# Altium schematic sheet Engine.SchDoc: ENGINE MANAGEMENT BOARD
size Letter; DrawnBy: Prithvi Shankara; DocumentNumber: 1; Revision: A; SheetNumber: 1; SheetTotal: 1
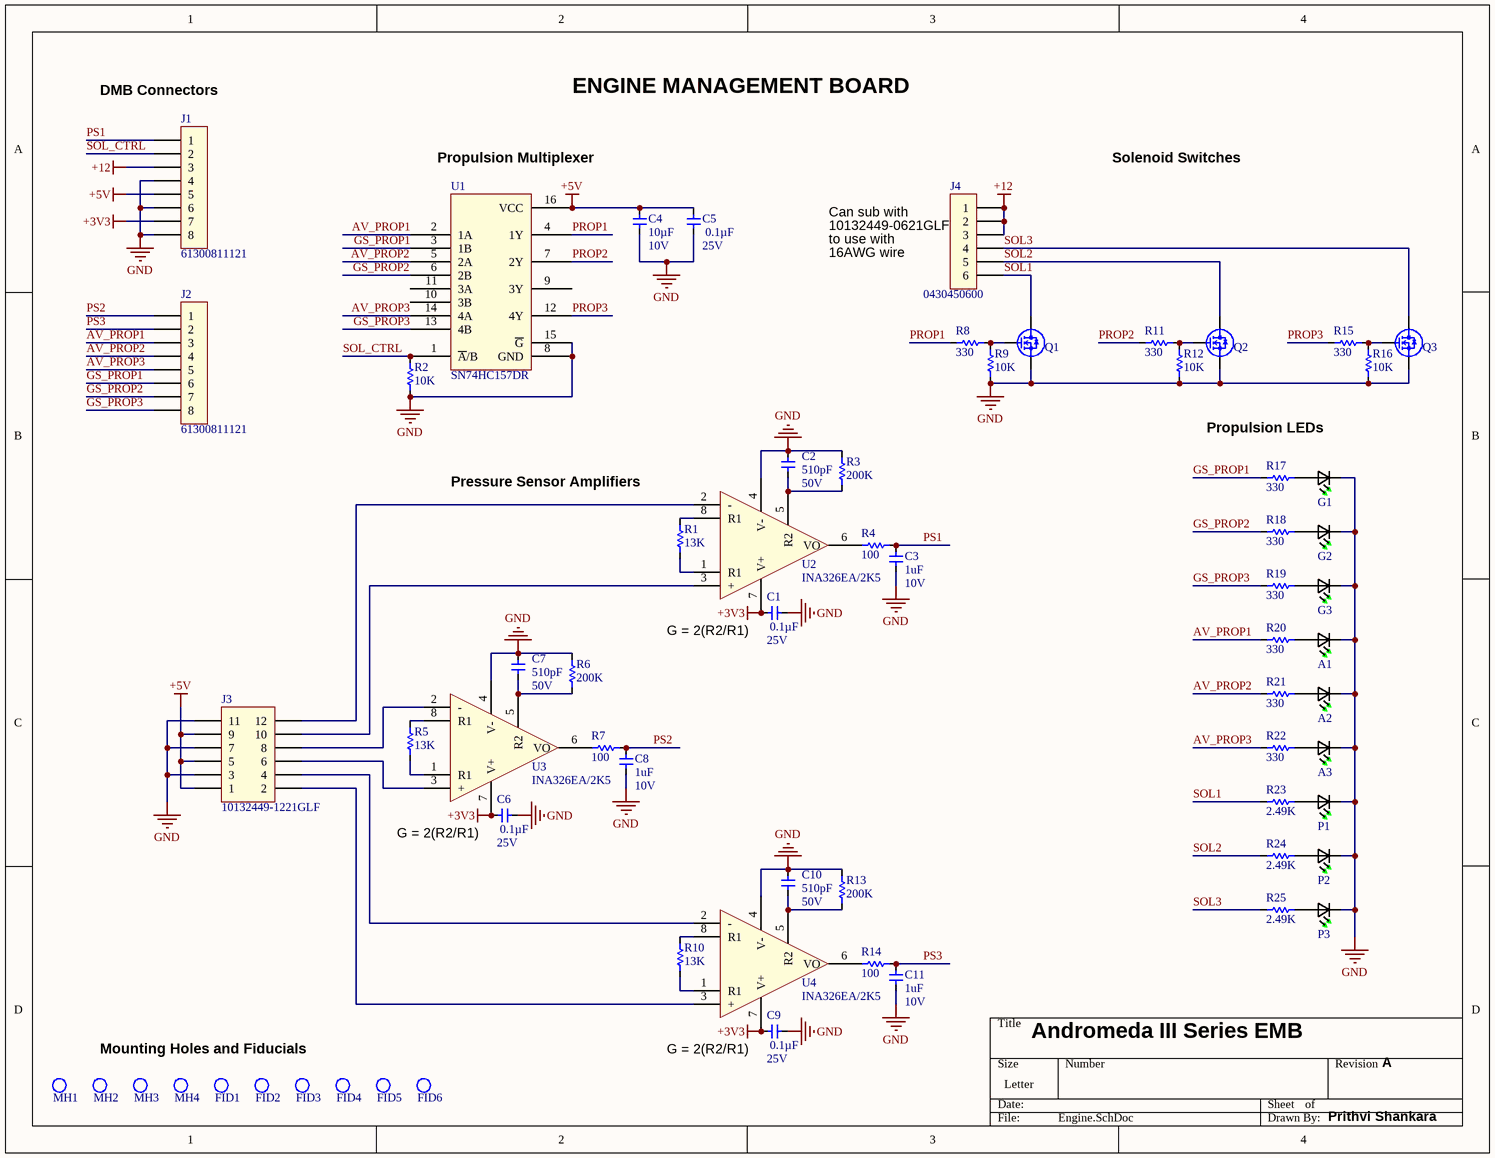
[diagram p0: Engine.SchDoc]

## Parts
A1  LTST-C191KGKT  [LTST-C191KGKT]  (value not drawn)
A2  LTST-C191KGKT  [LTST-C191KGKT]  (value not drawn)
A3  LTST-C191KGKT  [LTST-C191KGKT]  (value not drawn)
C1  Capacitance: 0.1µF  Voltage - Rated: 25V  [0603[1608]]  (hidden comment: CGA3E2X7R1E104K080AA)
C2  Capacitance: 510pF  Voltage - Rated: 50V  [0603[1608]]  (hidden comment: CC0603JRNPO9BN511)
C3  Capacitance: 1uF  Voltage - Rated: 10V  [0603[1608]]  (hidden comment: CL10A105KP8NNNC)
C4  Capacitance: 10µF  Voltage - Rated: 10V  [0603[1608]]  (hidden comment: CL10A106MP8NNNC)
C5  Capacitance: 0.1µF  Voltage - Rated: 25V  [0603[1608]]  (hidden comment: CGA3E2X7R1E104K080AA)
C6  Capacitance: 0.1µF  Voltage - Rated: 25V  [0603[1608]]  (hidden comment: CGA3E2X7R1E104K080AA)
C7  Capacitance: 510pF  Voltage - Rated: 50V  [0603[1608]]  (hidden comment: CC0603JRNPO9BN511)
C8  Capacitance: 1uF  Voltage - Rated: 10V  [0603[1608]]  (hidden comment: CL10A105KP8NNNC)
C9  Capacitance: 0.1µF  Voltage - Rated: 25V  [0603[1608]]  (hidden comment: CGA3E2X7R1E104K080AA)
C10  Capacitance: 510pF  Voltage - Rated: 50V  [0603[1608]]  (hidden comment: CC0603JRNPO9BN511)
C11  Capacitance: 1uF  Voltage - Rated: 10V  [0603[1608]]  (hidden comment: CL10A105KP8NNNC)
FID1  FID_1MM_ROUND_SL  [FID_1MM_ROUND_SL]  (value not drawn)  (no BOM)
FID2  FID_1MM_ROUND_SL  [FID_1MM_ROUND_SL]  (value not drawn)  (no BOM)
FID3  FID_1MM_ROUND_SL  [FID_1MM_ROUND_SL]  (value not drawn)  (no BOM)
FID4  FID_1MM_ROUND_SL  [FID_1MM_ROUND_SL]  (value not drawn)  (no BOM)
FID5  FID_1MM_ROUND_SL  [FID_1MM_ROUND_SL]  (value not drawn)  (no BOM)
FID6  FID_1MM_ROUND_SL  [FID_1MM_ROUND_SL]  (value not drawn)  (no BOM)
G1  LTST-C191KGKT  [LTST-C191KGKT]  (value not drawn)
G2  LTST-C191KGKT  [LTST-C191KGKT]  (value not drawn)
G3  LTST-C191KGKT  [LTST-C191KGKT]  (value not drawn)
J1  61300811121  [61300811121]
J2  61300811121  [61300811121]
J3  10132449-1221GLF  [10132449-1221GLF]
J4  0430450600  [0430450600]
MH1  9774110360R  [Standoff]  (value not drawn)
MH2  9774110360R  [Standoff]  (value not drawn)
MH3  Mounting Hole  [MOUNT-HOLE]  (value not drawn)  (no BOM)
MH4  Mounting Hole  [MOUNT-HOLE]  (value not drawn)  (no BOM)
P1  LTST-C191KGKT  [LTST-C191KGKT]  (value not drawn)
P2  LTST-C191KGKT  [LTST-C191KGKT]  (value not drawn)
P3  LTST-C191KGKT  [LTST-C191KGKT]  (value not drawn)
Q1  DMN3023L-7  [DMN3023L-7]  (value not drawn)
Q2  DMN3023L-7  [DMN3023L-7]  (value not drawn)
Q3  DMN3023L-7  [DMN3023L-7]  (value not drawn)
R1  Resistance: 13K  [0603[1608]]  (hidden comment: MCT06030C1302FP500)
R2  Resistance: 10K  [0603[1608]]  (hidden comment: ERJ-3GEYJ103V)
R3  Resistance: 200K  [0603[1608]]  (hidden comment: ERJ-3EKF2003V)
R4  Resistance: 100  [0603[1608]]  (hidden comment: ESR03EZPJ101)
R5  Resistance: 13K  [0603[1608]]  (hidden comment: MCT06030C1302FP500)
R6  Resistance: 200K  [0603[1608]]  (hidden comment: ERJ-3EKF2003V)
R7  Resistance: 100  [0603[1608]]  (hidden comment: ESR03EZPJ101)
R8  Resistance: 330  [0603[1608]]  (hidden comment: RC1608F331CS)
R9  Resistance: 10K  [0603[1608]]  (hidden comment: ERJ-3GEYJ103V)
R10  Resistance: 13K  [0603[1608]]  (hidden comment: MCT06030C1302FP500)
R11  Resistance: 330  [0603[1608]]  (hidden comment: RC1608F331CS)
R12  Resistance: 10K  [0603[1608]]  (hidden comment: ERJ-3GEYJ103V)
R13  Resistance: 200K  [0603[1608]]  (hidden comment: ERJ-3EKF2003V)
R14  Resistance: 100  [0603[1608]]  (hidden comment: ESR03EZPJ101)
R15  Resistance: 330  [0603[1608]]  (hidden comment: RC1608F331CS)
R16  Resistance: 10K  [0603[1608]]  (hidden comment: ERJ-3GEYJ103V)
R17  Resistance: 330  [0603[1608]]  (hidden comment: RC1608F331CS)
R18  Resistance: 330  [0603[1608]]  (hidden comment: RC1608F331CS)
R19  Resistance: 330  [0603[1608]]  (hidden comment: RC1608F331CS)
R20  Resistance: 330  [0603[1608]]  (hidden comment: RC1608F331CS)
R21  Resistance: 330  [0603[1608]]  (hidden comment: RC1608F331CS)
R22  Resistance: 330  [0603[1608]]  (hidden comment: RC1608F331CS)
R23  Resistance: 2.49K  [0603[1608]]  (hidden comment: ERA-3AEB2491V)
R24  Resistance: 2.49K  [0603[1608]]  (hidden comment: ERA-3AEB2491V)
R25  Resistance: 2.49K  [0603[1608]]  (hidden comment: ERA-3AEB2491V)
U1  SN74HC157DR  [SOIC127P600X175-16N]
U2  INA326EA/2K5  [TSOP65P490X110-8N]
U3  INA326EA/2K5  [TSOP65P490X110-8N]
U4  INA326EA/2K5  [TSOP65P490X110-8N]

## Nets
+3V3: C1.2 C6.2 C9.2 J1.7 U2.7(V+) U3.7(V+) U4.7(V+)
+5V: C4.2 C5.2 J1.5 J3.1 J3.5 J3.9 U1.16(VCC)
+12: J1.3 J4.1 J4.2 J4.3
GND: A1.1(K2) A2.1(K2) A3.1(K2) C1.1 C2.1 C3.1 C4.1 C5.1 C6.1 C7.1 C8.1 C9.1 C10.1 C11.1 G1.1(K2) G2.1(K2) G3.1(K2) J1.4 J1.6 J1.8 J3.3 J3.7 J3.11 P1.1(K2) P2.1(K2) P3.1(K2) Q1.2(S) Q2.2(S) Q3.2(S) R2.1 R3.1 R6.1 R9.1 R12.1 R13.1 R16.1 U1.8(GND) U1.15(~{G}) U2.4(V-) U3.4(V-) U4.4(V-)
AV_PROP1: J2.3 R20.2 U1.2(1A)
AV_PROP2: J2.4 R21.2 U1.5(2A)
AV_PROP3: J2.5 R22.2 U1.14(4A)
GS_PROP1: J2.6 R17.2 U1.3(1B)
GS_PROP2: J2.7 R18.2 U1.6(2B)
GS_PROP3: J2.8 R19.2 U1.13(4B)
PROP1: R8.1 U1.4(1Y)
PROP2: R11.1 U1.7(2Y)
PROP3: R15.1 U1.12(4Y)
PS1: C3.2 J1.1 R4.2
PS2: C8.2 J2.1 R7.2
PS3: C11.2 J2.2 R14.2
SOL1: J4.6 Q1.3(D) R23.2
SOL2: J4.5 Q2.3(D) R24.2
SOL3: J4.4 Q3.3(D) R25.2
SOL_CTRL: J1.2 R2.2 U1.1(~{A}/B)
NetA1_2: A1.2(A2) R20.1
NetA2_2: A2.2(A2) R21.1
NetA3_2: A3.2(A2) R22.1
NetC2_2: C2.2 R3.2 U2.5(R2)
NetC7_2: C7.2 R6.2 U3.5(R2)
NetC10_2: C10.2 R13.2 U4.5(R2)
NetG1_2: G1.2(A2) R17.1
NetG2_2: G2.2(A2) R18.1
NetG3_2: G3.2(A2) R19.1
NetJ3_2: J3.2 U4.3(+)
NetJ3_4: J3.4 U4.2(-)
NetJ3_6: J3.6 U3.3(+)
NetJ3_8: J3.8 U3.2(-)
NetJ3_10: J3.10 U2.3(+)
NetJ3_12: J3.12 U2.2(-)
NetP1_2: P1.2(A2) R23.1
NetP2_2: P2.2(A2) R24.1
NetP3_2: P3.2(A2) R25.1
NetQ1_1: Q1.1(G) R8.2 R9.2
NetQ2_1: Q2.1(G) R11.2 R12.2
NetQ3_1: Q3.1(G) R15.2 R16.2
NetR1_1: R1.1 U2.8(R1)
NetR1_2: R1.2 U2.1(R1)
NetR4_1: R4.1 U2.6(VO)
NetR5_1: R5.1 U3.8(R1)
NetR5_2: R5.2 U3.1(R1)
NetR7_1: R7.1 U3.6(VO)
NetR10_1: R10.1 U4.8(R1)
NetR10_2: R10.2 U4.1(R1)
NetR14_1: R14.1 U4.6(VO)

Not connected (* = marked no-connect by the designer): U1 9(3Y) 10(3B) 11(3A)

## Notes on the sheet
- (near J1) DMB Connectors
- ENGINE MANAGEMENT BOARD
- Propulsion Multiplexer
- Solenoid Switches
- Can sub with
- (near J4) 10132449-0621GLF
- to use with
- 16AWG wire
- Propulsion LEDs
- Pressure Sensor Amplifiers
- G = 2(R2/R1)
- Andromeda III Series EMB
- Mounting Holes and Fiducials
- A
- Prithvi Shankara

## Library data of the parts
A1-A3 G1-G3 P1-P3 = LTST-C191KGKT: LED GREEN CLEAR SMD 0603; Manufacturer: Lite-On Inc.; Lens Color: Colourless; Millicandela Rating: 35mcd; Lens Style: Rectangle with Flat Top; Lens Size: 1.10mm x 0.80mm; Voltage - Forward (Vf) (Typ): 2V; Current - Test: 20mA; Viewing Angle: 130°; Wavelength - Dominant: 571nm; Wavelength - Peak: 574nm; ComponentLink1Description: Datasheet; ComponentLink1URL: http://optoelectronics.liteon.com/upload/download/DS22-2000-228/LTST-C191KGKT.PDF; Manufacturer Part Number: LTST-C191KGKT; Colour: Green; Lens Transparency: Clear; Mounting Type: Surface Mount; Package / Case: 0603 (1608 Metric); Size / Dimension: 1.60mm L x 0.80mm W; Height (Max): 0.65mm; Supplier 1: Digi-Key; Supplier Part Number 1: 160-1446-1-ND
C1 C5 C6 C9 = CGA3E2X7R1E104K080AA: CAP CER 0.1UF 25V X7R 0603; Manufacturer: TDK Corporation; Tolerance: ±10%; Temperature Coefficient: X7R; Operating Temperature: -55°C ~ 125°C; Mounting Type: Surface Mount, MLCC; Package / Case: 0603 (1608 Metric); Size / Dimension: 0.063" L x 0.031" W (1.60mm x 0.80mm); Manufacturer Part Number: CGA3E2X7R1E104K080AA; Thickness (Max): 0.035" (0.90mm); ComponentLink1Description: Datasheet; ComponentLink1URL: https://product.tdk.com/info/en/catalog/spec/mlccspec_automotive_general_en.pdf; Supplier 1: Digi-Key; Supplier Part Number 1: 445-5667-1-ND
C2 C7 C10 = CC0603JRNPO9BN511: CAP CER 4.7UF 25V X5R 0603; Manufacturer: Yageo; Tolerance: ±5%; Temperature Coefficient: C0G, NP0; Operating Temperature: -55°C ~ 125°C; Mounting Type: Surface Mount, MLCC; Package / Case: 0603 (1608 Metric); Size / Dimension: 0.063" L x 0.031" W (1.60mm x 0.80mm); Manufacturer Part Number: CC0603JRNPO9BN511; Thickness (Max): 0.035" (0.90mm); ComponentLink1Description: Datasheet; ComponentLink1URL: https://www.yageo.com/upload/media/product/productsearch/datasheet/mlcc/UPY-GP_NP0_16V-to-50V_18.pdf; Supplier 1: Digi-Key; Supplier Part Number 1: 311-3972-1-ND
C3 C8 C11 = CL10A105KP8NNNC: CAP CER 1UF 10V X5R 0603; Manufacturer: Samsung Electro-Mechanics; Tolerance: ±10%; Temperature Coefficient: X5R; Operating Temperature: -55°C ~ 85°C; Mounting Type: Surface Mount, MLCC; Package / Case: 0603 (1608 Metric); Size / Dimension: 0.063" L x 0.031" W (1.60mm x 0.80mm); Manufacturer Part Number: CL10A105KP8NNNC; Thickness (Max): 0.035" (0.90mm); ComponentLink1Description: Datasheet; ComponentLink1URL: http://www.samsungsem.com/kr/support/product-search/mlcc/__icsFiles/afieldfile/2019/05/10/19-CL10A105KP8NNNC.pdf; Supplier 1: Digi-Key; Supplier Part Number 1: 1276-1182-1-ND
C4 = CL10A106MP8NNNC: CAP CER 10UF 10V X5R 0603; Manufacturer: Samsung Electro-Mechanics; Tolerance: ±20%; Temperature Coefficient: X5R; Operating Temperature: -55°C ~ 85°C; Mounting Type: Surface Mount, MLCC; Package / Case: 0603 (1608 Metric); Size / Dimension: 0.063" L x 0.031" W (1.60mm x 0.80mm); Manufacturer Part Number: CL10A106MP8NNNC; Thickness (Max): 0.035" (0.90mm); ComponentLink1Description: Datasheet; ComponentLink1URL: https://static6.arrow.com/aropdfconversion/f91a1722e2705c3d73cfb1979021b64ae4055093/19-cl10a106mp8nnnc.pdf; Supplier 1: Digi-Key; Supplier Part Number 1: 1276-1871-1-ND
FID1-FID6 = FID_1MM_ROUND_SL: Fiducial 1mm Round Single Layer
J1 J2 = 61300811121: CONN HEADER VERT 8POS  MALE 2.54MM; Manufacturer: Würth Elektronik; Pitch - Mating: 0.100" (2.54mm); Number of Positions: 8; Style: Board to Board or Cable; Shrouding: Unshrouded; Contact Length - Mating: 0.236" (6.00mm); Contact Length - Post: 0.118" (3.00mm); Overall Contact Length: 0.454" (11.54mm); Material Flammability Rating: UL94 V-0; Current Rating (Amps): 3A; Voltage Rating: 250V; ComponentLink1Description: Drawing; ComponentLink1URL: https://www.we-online.de/katalog/datasheet/6130xx11121.pdf; Manufacturer Part Number: 61300811121; Connector Type: Header; Contact Type: Male Pin; Number of Rows: 1; Mounting Type: Through Hole; Termination: Solder; Fastening Type: Push-Pull; Insulation Height: 0.100" (2.54mm); Contact Shape: Square; Contact Finish - Mating: Gold; Contact Material: Copper Alloy; Insulation Material: Polybutylene Terephthalate (PBT); Operating Temperature: -40°C ~ 105°C; Insulation Color: Black; Supplier 1: Digi-Key; Supplier Part Number 1: 732-5321-ND
J3 = 10132449-1221GLF: CONN HEADER R/A 12POS 3MM; Manufacturer: Amphenol ICC (FCI); Pitch - Mating: 0.118" (3.00mm); Number of Positions: 12; Number of Positions Loaded: All; Style: Board to Cable/Wire; Shrouding: Shrouded - 4 Wall; Contact Length - Post: 0.126" (3.20mm); Material Flammability Rating: UL94 V-0; Voltage Rating: 250V; ComponentLink1Description: Datasheet; ComponentLink1URL: https://cdn.amphenol-icc.com/media/wysiwyg/files/documentation/datasheet/boardwiretoboard/bwb_minitekpwr3.0_hcc.pdf?__cf_chl_jschl_tk__=5b50c337d7977d3136f5a7e9c1a5138446a86722-1578191481-0-AdRe7fXYrldvOZ_oqyXIDS1Fw-yIkYCF-QCdaR8gv5bvudzwMePuF1OnY_qX9R1SRbUtnU8KyfMeQWvo-tgbYDs0UY0fEf2VYly7RnE44wN6RCRwe79pwwTkwB-vrp_E3FFt_m8Gv1l0VQgfDvqJJh9NWsFdXN6uiHYgEWJHQlxni9pgO_Rgu9b74Q_adNTuUPkDts4F_sjwuXFS2gwZ4qhDRVIbOsJk9z2IFwtIQbJe2Vjr12REDPUJnSIFI5L_m3PVR56FMV99EE0fexLx9E4Xzm8z4yXY4QuL_nxicuZLnFM8rKw84cv6VQDtrcv1h8b5URSWpnxkbKmN-6xqBT_N2gwuiomQytubllip4AB4QtXNO4uZy8p0Kaq8ZXDsS9f0XOGpGrNCvURFRCr5YrB2nakG2mZwStZMD_Rr-W-x1kEQ5VT0_Uar3vHfURsPPw; ComponentLink2Description: Drawing; ComponentLink2URL: https://cdn.amphenol-icc.com/media/wysiwyg/files/drawing/10132449.pdf?__cf_chl_jschl_tk__=3fb7538f61705fd3db72d6547b71e22025aaeae6-1578191484-0-ARZmBU2d2iTfwOyvkDW6juGvz8Wa7jPk-lPTAGC3bi6AwA2PAOw_83XbqimUoaj63c73oghkBl5EBlxfVnJt5FnKIy9_Ampqry6wpxN3P9yFfGzzu2bzrkjXc8H98cNGfE4yNZOx4lVYAc0DYF8iUgUBt3ot3PAqRWTuL_OE0dIKXvMd7u_4fU7igR1oB3QBFAu564mexcV1Dg4phJ9BA4kHFs6CIC10MmA2ZlPsaDWmfr6ivcYRarJOnVBN46Piz5s9Rafd2OkXuSIM4yJjlli4dKOItRDrJD3hRC0iA9RVgXipc9Ibd3Qny2RaW6xQiV-dovtBkpyFUGJQUyK5Difre6fQiv59Vrr2PfvD74WBgrERIBaIQ4JCRXFCC0XHSA; Supplier 1: Digi-Key; Supplier Part Number 1: 609-5289-ND; Contact Type: Male Pin; Number of Rows: 2; Row Spacing - Mating: 0.118" (3.00mm); Mounting Type: Through Hole, Right Angle; Termination: Solder; Fastening Type: Locking Ramp; Insulation Height: 0.343" (8.71mm); Contact Shape: Square; Contact Finish - Mating: Tin; Contact Finish - Post: Tin; Contact Material: Copper Alloy; Insulation Material: Polyamide (PA9T), Nylon 9T; Features: Board Lock, Glow Wire Compliant; Operating Temperature: -40°C ~ 105°C; Insulation Color: Black; Manufacturer Part Number: 10132449-1221GLF
J4 = 0430450600: CONN HEADER R/A 6POS 3MM; Manufacturer: Molex; Number of Positions: 6; Row Spacing - Mating: 0.118" (3.00mm); Shrouding: Shrouded - 4 Wall; Contact Length - Post: 0.125" (3.18mm); Material Flammability Rating: UL94 V-0; Current Rating (Amps): 8A; Voltage Rating: 600V; ComponentLink1Description: Drawing; ComponentLink1URL: https://www.molex.com/pdm_docs/sd/430450600_sd.pdf; ComponentLink2Description: Product Specification; ComponentLink2URL: https://www.molex.com/pdm_docs/ps/PS-43045.pdf; Manufacturer Part Number: 0430450600; Contact Type: Male Pin; Number of Rows: 2; Mounting Type: Through Hole, Right Angle; Termination: Solder; Fastening Type: Locking Ramp; Insulation Height: 0.290" (7.37mm); Contact Shape: Square; Contact Finish - Mating: Tin; Contact Finish Thickness - Mating: 100.0µin (2.54µm); Contact Finish - Post: Tin; Contact Material: Brass; Insulation Material: Liquid Crystal Polymer (LCP), Glass Filled; Features: Board Lock; Insulation Color: Black; Supplier 1: Digi-Key; Supplier Part Number 1: WM1815-ND
MH1 MH2 = 9774110360R: ROUND STANDOFF M3X0.5 STEEL 11MM; Manufacturer: Würth Elektronik; Threaded/Unthreaded: Threaded; Gender: Female; Between Board Height: 0.433" (11.00mm); ComponentLink1Description: Datasheet; ComponentLink1URL: https://www.keyelco.com/userAssets/file/M65p77.pdf; Manufacturer Part Number: 9774110360R; Type: Round Standoff; Screw, Thread Size: M3x0.5; Diameter - Outside: 0.236" (5.99mm); Length - Overall: 0.488" (12.40mm); Material: Steel; Features: Surface Mount; Supplier 1: Digi-Key; Supplier Part Number 1: 732-5278-1-ND
MH3 MH4 = Mounting Hole: #4 Screw, 0.116in Diameter
Q1-Q3 = DMN3023L-7: MOSFET N-CH 30V 6.2A SOT23; Manufacturer: Diodes Incorporated; FET Type: N-Channel; Current - Continuous Drain (Id) @ 25C: 6.2A (Ta); Drive Voltage (Max Rds On, Min Rds On): 2.5V, 10V; Rds On (Max) @ Id, Vgs: 25mOhm @ 4A, 10V; Vgs(th) (Max) @ Id: 1.8V @ 250µA; Gate Charge (Qg) (Max) @ Vgs: 18.4nC @10V; Vgs (Max): +-20V; Input Capacitance (Ciss) (Max) @ Vds: 873pF @ 15V; Power Dissipation (Max): 900mW (Ta); Supplier 1: Digi-Key; Technology: MOSFET (Metal Oxide); Drain to Source Voltage (Vdss): 30V; Operating Temperature: -55°C ~ 150°C (TJ); Mounting Type: Surface Mount; Supplier Device Package: SOT-23; Supplier Part Number 1: DMN3023L-7DICT-ND; ComponentLink1Description: Datasheet; ComponentLink1URL: https://www.diodes.com/assets/Datasheets/DMN3023L.pdf
R1 R5 R10 = MCT06030C1302FP500: RES SMD 13K OHM 1% 1/8W 0603; Manufacturer: Vishay Beyschlag; Power (Watts): 0.125W, 1/8W; Temperature Coefficient: ±50ppm/°C; ComponentLink1Description: Datasheet; ComponentLink1URL: http://www.vishay.com/docs/28705/mcx0x0xpro.pdf; Manufacturer Part Number: MCT06030C1302FP500; Tolerance: ±1%; Composition: Thin Film; Features: Anti-Sulfur; Operating Temperature: -55°C ~ 155°C; Package / Case: 0603 (1608 Metric); Supplier Device Package: 0603; Size / Dimension: 0.061" L x 0.033" W (1.55mm x 0.85mm); Height - Seated (Max): 0.022" (0.55mm); Number of Terminations: 2; Supplier 1: Digi-Key; Supplier Part Number 1: 749-1606-1-ND
R2 R9 R12 R16 = ERJ-3GEYJ103V: RES SMD 10K OHM 5% 1/10W 0603; Manufacturer: Panasonic Electronic Components; Power  (W): 0.1W; Temperature Coefficient: ±200ppm/°C; Package: 0603 (1608 Metric); Tolerance: ±5%; Operating Temperature: -55°C ~ 155°C; Composition: Thick Film; Manufacturer Part Number: ERJ-3GEYJ103V; ComponentLink1Description: Datasheet; Supplier 1: Digi-Key; Supplier Part Number 1: P10KGCT-ND
  R2: ComponentLink1URL: http://www.yageo.com/documents/recent/PYu-RC_Group_51_RoHS_L_9.pdf
  R9 R12 R16: ComponentLink1URL: https://industrial.panasonic.com/cdbs/www-data/pdf/RDA0000/DMA0000COL11.pdf; ComponentLink2Description: Land Pattern; ComponentLink2URL: https://industrial.panasonic.com/cdbs/www-data/pdf/RDA0000/DMA0000COL17.pdf
R3 R6 R13 = ERJ-3EKF2003V: RES SMD 200K OHM 1% 1/10W 0603; Manufacturer: Panasonic Electronic Components; Power  (W): 0.1W; Temperature Coefficient: ±100ppm/°C; Package: 0603 (1608 Metric); Tolerance: ±1%; Operating Temperature: -55°C ~ 155°C; Composition: Thick Film; Manufacturer Part Number: ERJ-3EKF2003V; ComponentLink1Description: Datasheet; ComponentLink1URL: https://industrial.panasonic.com/cdbs/www-data/pdf/RDA0000/AOA0000C304.pdf; Supplier 1: Digi-Key; Supplier Part Number 1: P200KHCT-ND
R4 R7 R14 = ESR03EZPJ101: RES SMD 100 OHM 5% 1/4W 0603; Manufacturer: Rohm Semiconductor; Power  (W): 0.25W; Temperature Coefficient: ±200ppm/°C; Package: 0603 (1608 Metric); Tolerance: ±5%; Operating Temperature: -55°C ~ 155°C; Composition: Thick Film; Manufacturer Part Number: ESR03EZPJ101; ComponentLink1Description: Datasheet; ComponentLink1URL: https://d1d2qsbl8m0m72.cloudfront.net/en/products/databook/datasheet/passive/resistor/chip_resistor/esr-e.pdf; Supplier 1: Digi-Key; Supplier Part Number 1: RHM100DCT-ND
R8 R11 R15 R17-R22 = RC1608F331CS: RES SMD 330 OHM 1% 1/10W 0603; Manufacturer: Samsung Electro-Mechanics; Power  (W): 0.1W; Temperature Coefficient: ±100ppm/°C; Package: 0603 (1608 Metric); Tolerance: ±1%; Operating Temperature: -55°C ~ 155°C; Composition: Thick Film; Manufacturer Part Number: RC1608F331CS; ComponentLink1Description: Datasheet; ComponentLink1URL: http://www.samsungsem.com/kr/support/product-search/chip-resistor/__icsFiles/afieldfile/2019/01/21/RC_Spec_Sheet(1901).pdf; Supplier 1: Digi-Key; Supplier Part Number 1: 1276-4604-2-ND
R23-R25 = ERA-3AEB2491V: RES SMD 2.49KOHM 0.1% 1/10W 0603; Manufacturer: Panasonic Electronic Components; Power  (W): 0.1W; Temperature Coefficient: ±25ppm/°C; Package: 0603 (1608 Metric); Tolerance: ±0.1%; Operating Temperature: -55°C ~ 155°C; Composition: Thin Film; Manufacturer Part Number: ERA-3AEB2491V; ComponentLink1Description: Datasheet; ComponentLink1URL: https://industrial.panasonic.com/cdbs/www-data/pdf/RDM0000/AOA0000C307.pdf; Supplier 1: Digi-Key; Supplier Part Number 1: P2.49KDBCT-ND
U1 = SN74HC157DR: IC QUAD 2-1LN DATASEL/MUX 16SOIC; Manufacturer: Texas Instruments; Circuit: 4 x 2:1; Independent Circuits: 1; Current - Output High, Low: 7.8mA, 7.8mA; Voltage Supply Source: Single Supply; Voltage - Supply: 2V ~ 6V; ComponentLink1Description: Datasheet; ComponentLink1URL: http://www.ti.com/lit/ds/symlink/sn74hc157.pdf; Supplier 1: Digi-Key; Supplier Part Number 1: 296-14836-2-ND; Manufacturer Part Number: SN74HC157DR; Type: Multiplexer; Operating Temperature: -40°C ~ 85°C; Mounting Type: Surface Mount; Package / Case: 16-SOIC (0.154", 3.90mm Width); Supplier Device Package: 16-SOIC; Base Part Number: 74HC157
U2-U4 = INA326EA/2K5: IC INST AMP 1 CIRCUIT 8VSSOP; Manufacturer: Texas Instruments; Amplifier Type: Instrumentation; Number of Circuits: 1; Output Type: Rail-to-Rail; -3db Bandwidth: 1kHz; Current - Input Bias: 200pA; Voltage - Input Offset: 20µV; Current - Supply: 2.4mA; Current - Output / Channel: 25mA; Voltage - Supply, Single/Dual (±): 2.7V ~ 5.5V, ±1.35V ~ 2.75V; ComponentLink1Description: Datasheet; ComponentLink1URL: http://www.ti.com/lit/ds/symlink/ina326.pdf; Operating Temperature: -40°C ~ 85°C; Mounting Type: Surface Mount; Package / Case: 8-TSSOP, 8-MSOP (0.118", 3.00mm Width); Supplier Device Package: 8-VSSOP; Base Part Number: INA326; Supplier 1: Digi-Key; Supplier Part Number 1: INA326EA/2K5CT-ND; Manufacturer Part Number: INA326EA/2K5